# EasyEDA schematic SCH_Esp32_2023-03-19.json
TITLE: Sheet_1; REV: 1.0; Date: 2023-03-19; Sheet: 1/1; Drawn By: jeagerines; Company: Your Company
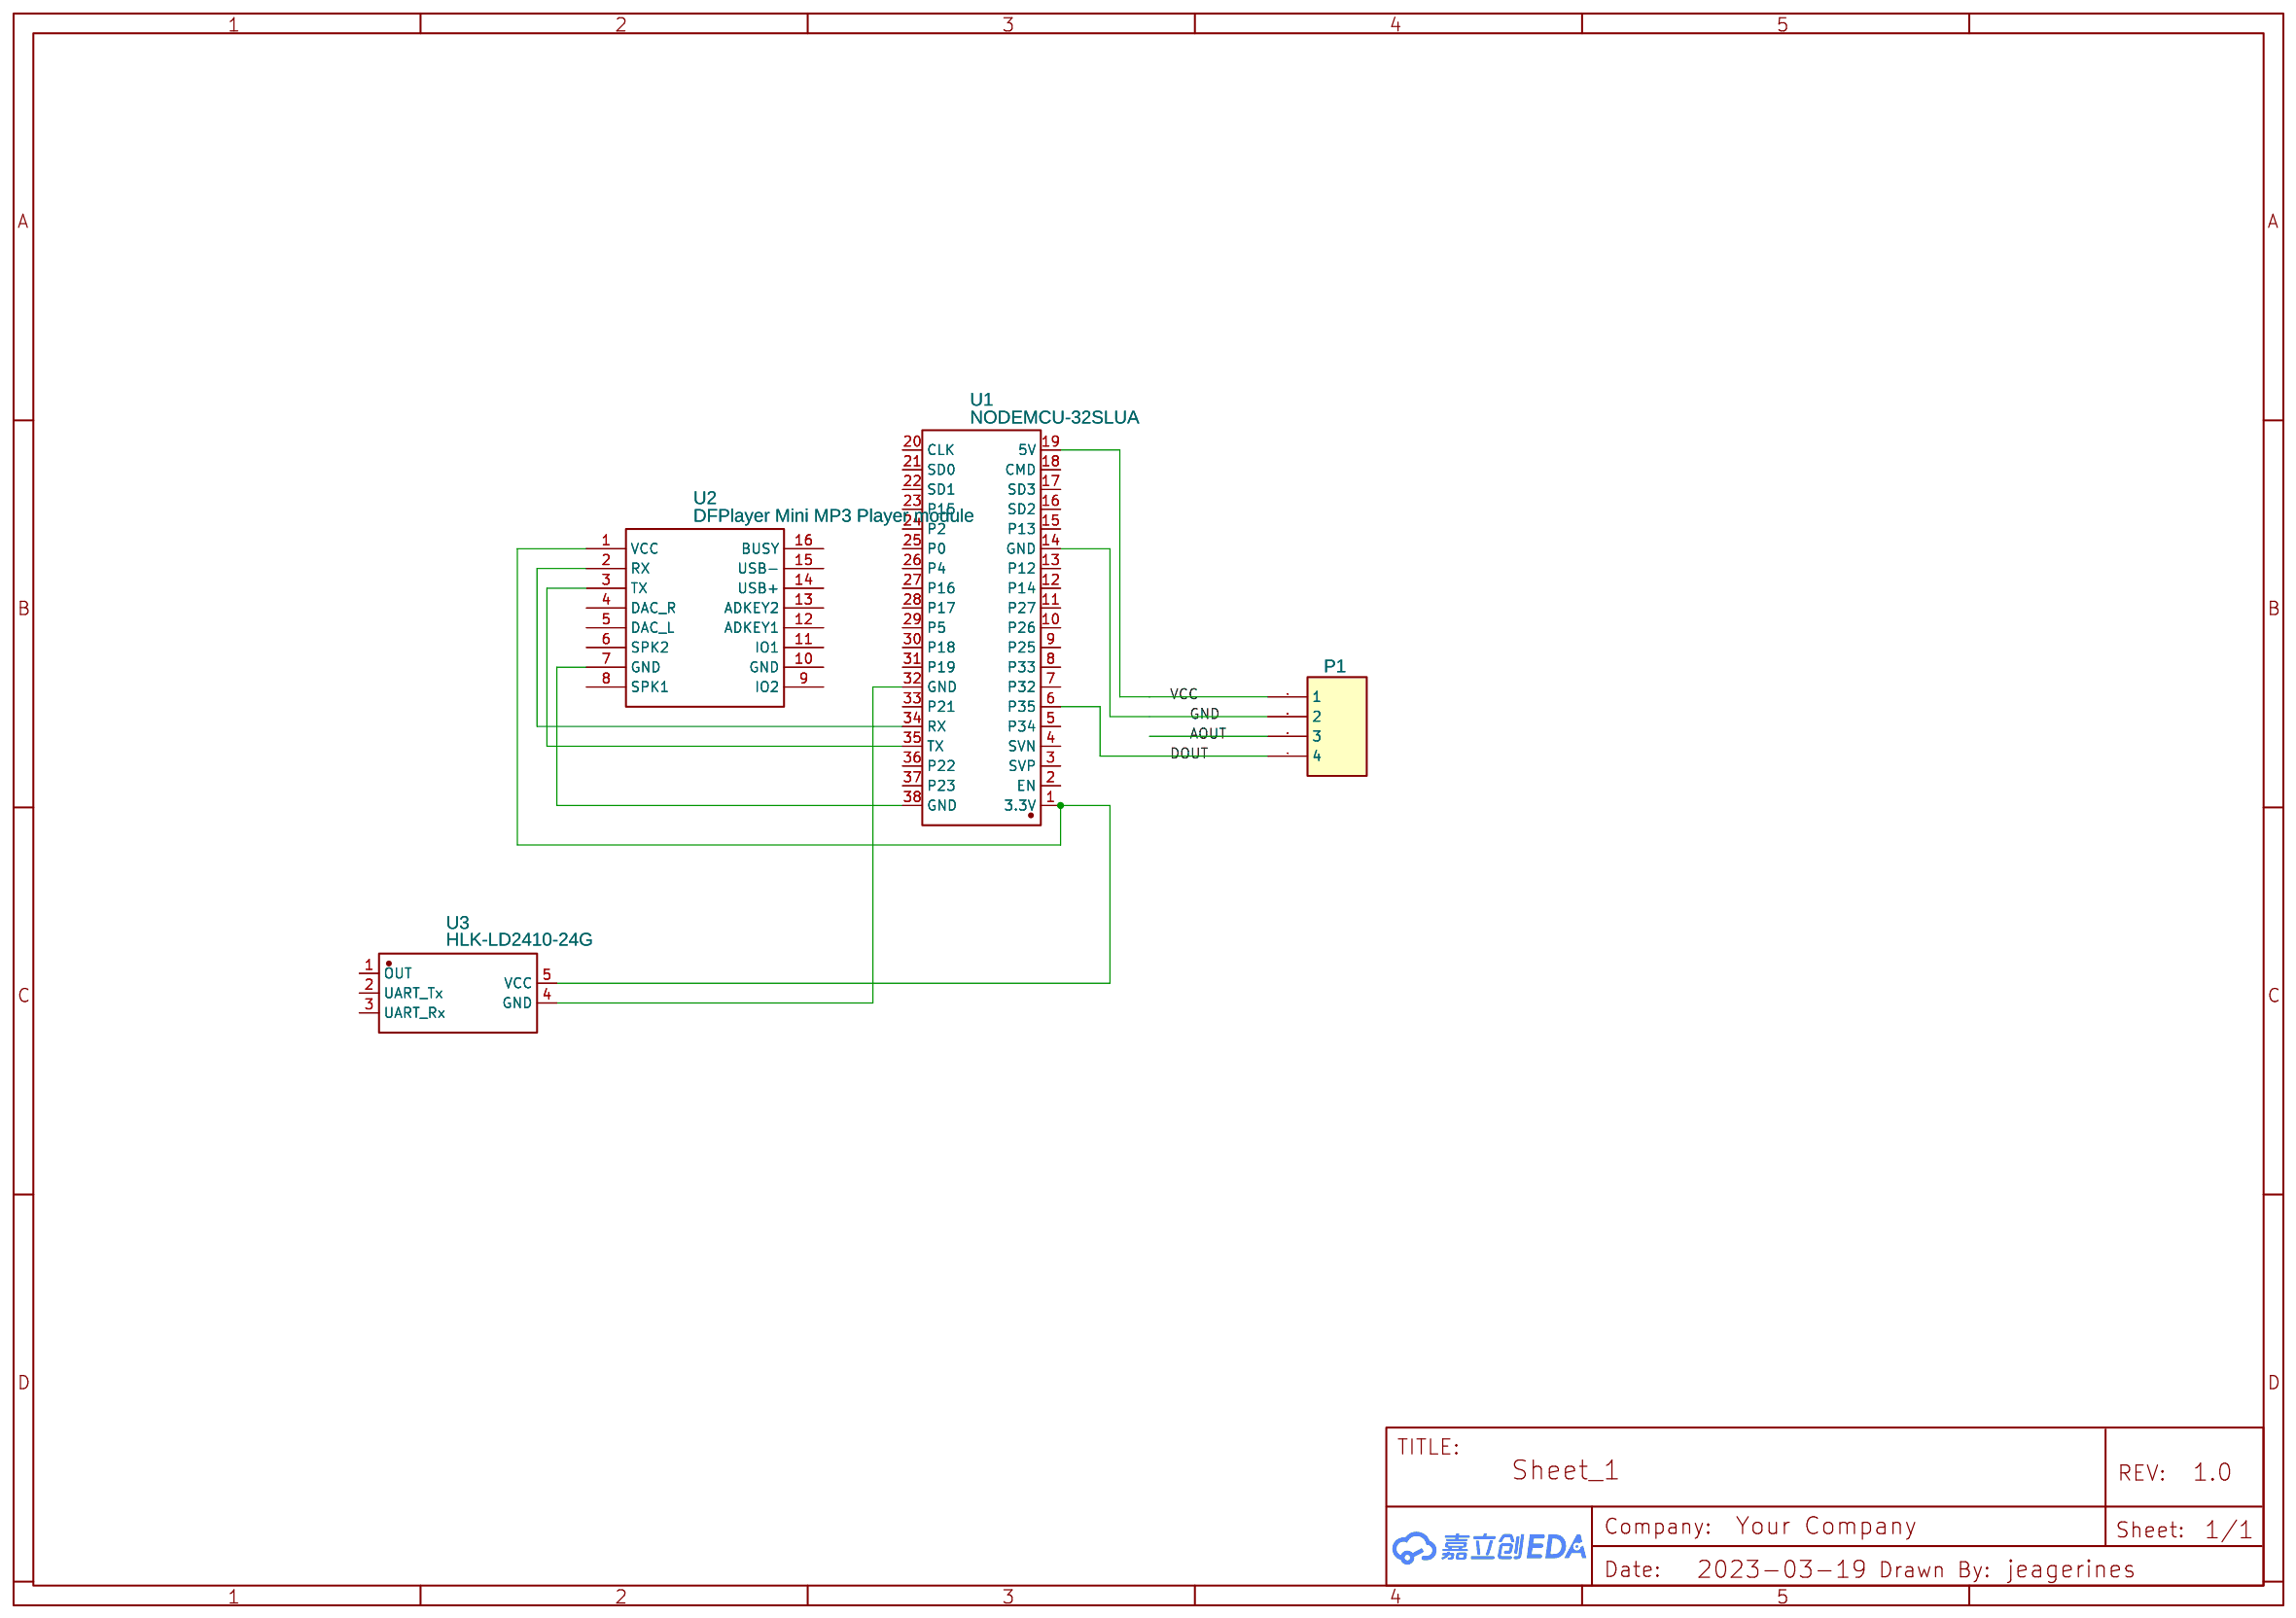
[diagram p0: schematic sheet]

## Parts
P1  SIP4  [HDR1X4]
U1  NODEMCU-32SLUA  [COMM-TH_NODEMCU-32SLUA]
U2  DFPlayer Mini MP3 Player module  [DFPLAYER MINI MP3 PLAYER MODULE]
U3  HLK-LD2410-24G  [TH_HLK-LD2410-24G]

## Library data of the parts
P1 = -: catid: 20; Manufacturer Part: ?
U1 = NODEMCU-32SLUA: Supplier: LCSC; Supplier Part: C111436; Manufacturer: Ai-Thinker(安信可); Manufacturer Part: NodeMCU-32SLua; link: https://atta.szlcsc.com/upload/public/pdf/source/20200715/C111436_7E615125D57381075B07FD61BFD5F595.pdf; JLCPCB Part Class: Extended Part; Contributor: lcsc
U2 = DFPlayer Mini MP3 Player module: link: http://image.dfrobot.com/image/data/DFR0299/DFPlayer%20Mini%20Manul.pdf; Contributor: hs3uka
U3 = HLK-LD2410-24G: Supplier: LCSC; Supplier Part: C9900024032; Manufacturer: null; link: https://atta.szlcsc.comnull; Contributor: lcsc

## Nets
GND: P1.2 U1.14(GND)
VCC: P1.1 U1.19(5V)
AOUT: P1.3
DOUT: P1.4 U1.6(P35)
Net-(U1-1): U1.1(3.3V) U2.1(VCC) U3.5(VCC)
Net-(U1-32): U1.32(GND) U3.4(GND)
Net-(U1-34): U1.34(RX) U2.2(RX)
Net-(U1-35): U1.35(TX) U2.3(TX)
Net-(U1-38): U1.38(GND) U2.7(GND)

Not connected (* = marked no-connect by the designer): U1 2(EN) 3(SVP) 4(SVN) 5(P34) 7(P32) 8(P33) 9(P25) 10(P26) 11(P27) 12(P14) 13(P12) 15(P13) 16(SD2) 17(SD3) 18(CMD) 20(CLK) 21(SD0) 22(SD1) 23(P15) 24(P2) 25(P0) 26(P4) 27(P16) 28(P17) 29(P5) 30(P18) 31(P19) 33(P21) 36(P22) 37(P23); U2 4(DAC_R) 5(DAC_L) 6(SPK2) 8(SPK1) 9(IO2) 10(GND) 11(IO1) 12(ADKEY1) 13(ADKEY2) 14(USB+) 15(USB-) 16(BUSY); U3 1(OUT) 2(UART_Tx) 3(UART_Rx)
